# EAGLE design photoduino.shield.shaton (EAGLE 6.4)
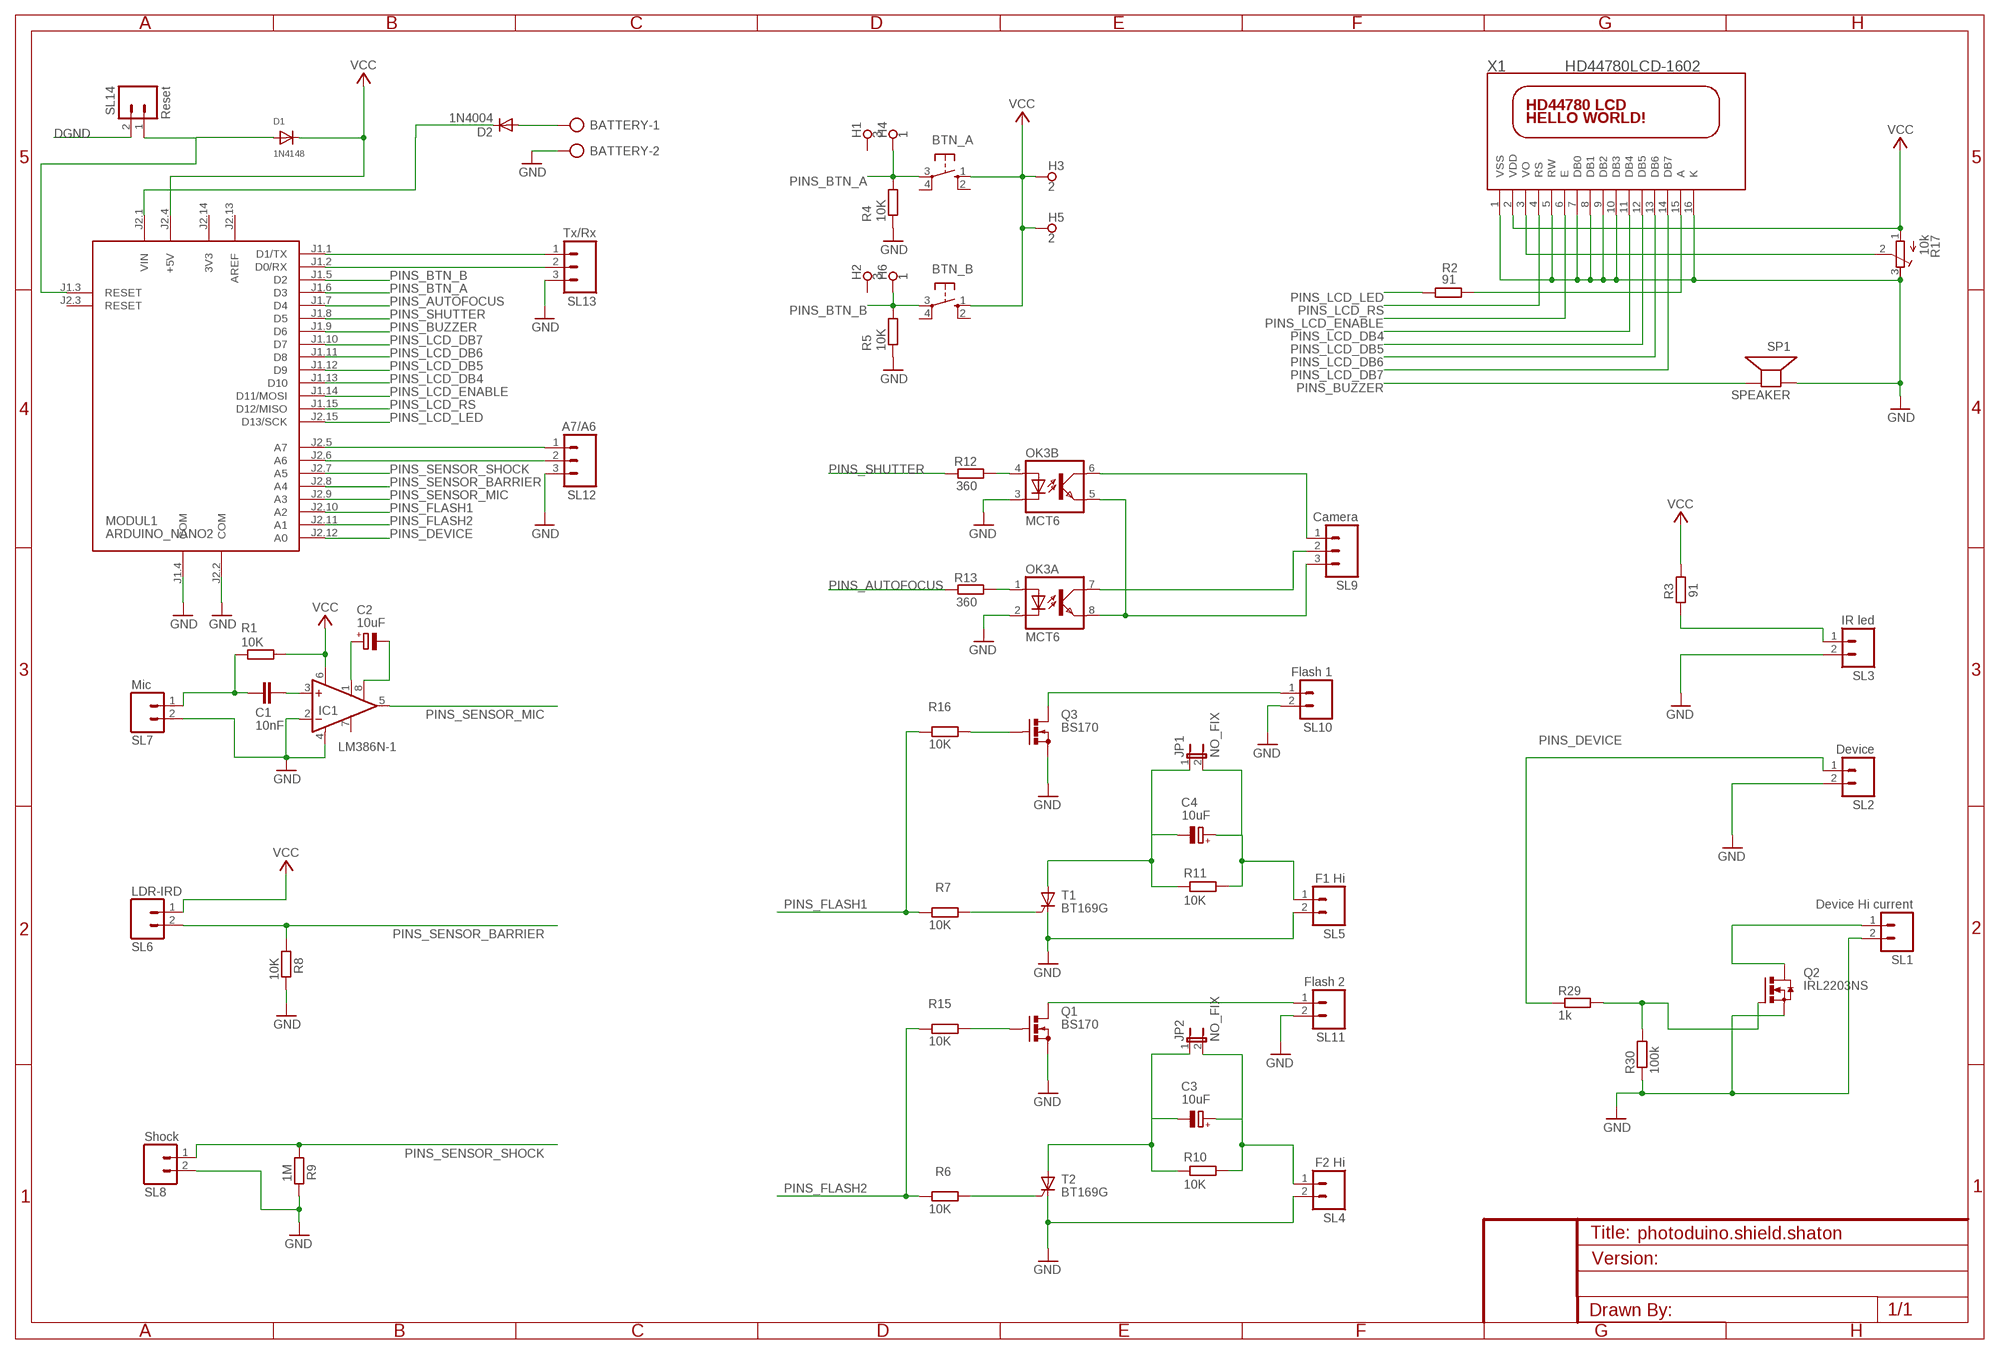
[diagram p0: schematic, sheet 1]

## Parts
BATTERY  AK500/2  [AK500/2]
BTN_A  10-XX  [B3F-10XX]
BTN_B  10-XX  [B3F-10XX]
C1  10nF  C-EU050-025X075  [C050-025X075]
C2  10uF  CPOL-EUE2.5-7  [E2,5-7]
C3  10uF  CPOL-EUE2.5-7  [E2,5-7]
C4  10uF  CPOL-EUE2.5-7  [E2,5-7]
D1  1N4148  DIODEDO-1N4148  [DO-1N4148]
D2  1N4004  [DO41-10]
H1  3  SPECIAL_DRILL_0.1000  [PAD_0.1000]
H2  3  SPECIAL_DRILL_0.1000  [PAD_0.1000]
H3  2  SPECIAL_DRILL_0.1000  [PAD_0.1000]
H4  1  SPECIAL_DRILL_0.1000  [PAD_0.1000]
H5  2  SPECIAL_DRILL_0.1000  [PAD_0.1000]
H6  1  SPECIAL_DRILL_0.1000  [PAD_0.1000]
IC1  LM386N-1  [DIL08]
JP1  NO_FIX  JP1E  [JP1]
JP2  NO_FIX  JP1E  [JP1]
MODUL1  ARDUINO_NANO2  [ARDUINO_NANO2]
OK3  MCT6  ILD2  [DIL08]
Q1  BS170  [SOT54E]
Q2  IRL2203NS  IRF3704S  [D2PACK]
Q3  BS170  [SOT54E]
R1  10K  R-EU_0207/7  [0207/7]
R2  91  R-EU_0207/7  [0207/7]
R3  91  R-EU_0207/7  [0207/7]
R4  10K  R-EU_0207/7  [0207/7]
R5  10K  R-EU_0207/7  [0207/7]
R6  10K  R-EU_0207/7  [0207/7]
R7  10K  R-EU_0207/7  [0207/7]
R8  10K  R-EU_0207/7  [0207/7]
R9  1M  R-EU_0207/7  [0207/7]
R10  10K  R-EU_0207/7  [0207/7]
R11  10K  R-EU_0207/7  [0207/7]
R12  360  R-EU_0207/7  [0207/7]
R13  360  R-EU_0207/7  [0207/7]
R15  10K  R-EU_0207/7  [0207/7]
R16  10K  R-EU_0207/7  [0207/7]
R17  10k  R-TRIMM64W  [RTRIM64W]
R29  1k  R-EU_0207/7  [0207/7]
R30  100k  R-EU_0207/7  [0207/7]
SL1  Device Hi current  M02  [02P]
SL2  Device  M02  [02P]
SL3  IR led  M02  [02P]
SL4  F2 Hi  M02  [02P]
SL5  F1 Hi  M02  [02P]
SL6  LDR-IRD  M02  [02P]
SL7  Mic  M02  [02P]
SL8  Shock  M02  [02P]
SL9  Camera  M03  [03P]
SL10  Flash 1  M02  [02P]
SL11  Flash 2  M02  [02P]
SL12  A7/A6  M03  [03P]
SL13  Tx/Rx  M03  [03P]
SL14  Reset  M02  [02P]
SP1  SPEAKER  SPEAKER/PS12  [PS12]
T1  BT169G  BT169  [TO92-2]
T2  BT169G  BT169  [TO92-2]
X1  HD44780LCD-1602  [LCD1602]

## Nets
DGND: BATTERY.2 IC1.2(-IN) IC1.4(GND) MODUL1.J1.4(COM) MODUL1.J2.2(COM) OK3.2(A:C) OK3.3(B:C) Q1.S Q2.3(S) Q3.S R4.1 R5.1 R8.2 R9.2 R17.3(A) R30.1 SL1.2 SL2.2 SL3.2 SL4.2 SL5.2 SL7.2 SL8.2 SL10.2 SL11.2 SL12.3 SL13.3 SL14.2 SP1.P$1(+) T1.C T2.C X1.1(VSS) X1.5(RW) X1.7(DB0) X1.8(DB1) X1.9(DB2) X1.10(DB3) X1.16(K) ; supply symbol labelled GND
LCD_CONTRAST: R17.2(S) X1.3(VO)
N$1: R3.2 SL3.1
N$2: OK3.5(B:EMIT) OK3.8(A:EMIT) SL9.3
N$3: C4.+ JP1.2 R11.2 SL5.1
N$4: R6.1 T2.G
N$5: D1.A MODUL1.J1.3(RESET) SL14.1
N$6: C4.- JP1.1 R11.1 T1.A
N$7: Q2.1(G) R29.2 R30.2
N$8: C3.+ JP2.2 R10.2 SL4.1
N$9: C3.- JP2.1 R10.1 T2.A
N$10: Q3.G R16.1
N$11: D2.C MODUL1.J2.1(VIN)
N$12: C1.1 IC1.3(+IN)
N$13: BATTERY.1 D2.A
N$14: MODUL1.J1.1(D1/TX) SL13.1
N$15: Q1.G R15.1
N$16: C1.2 R1.1 SL7.1
N$17: Q3.D SL10.1
N$18: R7.1 T1.G
N$19: Q1.D SL11.1
N$20: MODUL1.J1.2(D0/RX) SL13.2
N$21: OK3.6(B:COL) SL9.1
N$22: MODUL1.J2.5(A7) SL12.1
N$23: OK3.4(B:A) R12.1
N$24: MODUL1.J2.6(A6) SL12.2
N$25: OK3.1(A:A) R13.1
N$27: C2.+ IC1.1(GAIN)
N$28: Q2.2(D) SL1.1
N$31: C2.- IC1.8(GAIN)
N$32: R2.1 X1.15(A)
PINS_AUTOFOCUS: MODUL1.J1.7(D4) R13.2
PINS_BTN_A: BTN_A.3(P) H4.1 MODUL1.J1.6(D3) R4.2
PINS_BTN_B: BTN_B.3(P) H6.1 MODUL1.J1.5(D2) R5.2
PINS_BUZZER: MODUL1.J1.9(D6) SP1.P$2(-)
PINS_DEVICE: MODUL1.J2.12(A0) R29.1 SL2.1
PINS_FLASH1: MODUL1.J2.10(A2) R7.2 R16.2
PINS_FLASH2: MODUL1.J2.11(A1) R6.2 R15.2
PINS_LCD_DB4: MODUL1.J1.13(D10) X1.11(DB4)
PINS_LCD_DB5: MODUL1.J1.12(D9) X1.12(DB5)
PINS_LCD_DB6: MODUL1.J1.11(D8) X1.13(DB6)
PINS_LCD_DB7: MODUL1.J1.10(D7) X1.14(DB7)
PINS_LCD_ENABLE: MODUL1.J1.14(D11/MOSI) X1.6(E)
PINS_LCD_LED: MODUL1.J2.15(D13/SCK) R2.2
PINS_LCD_RS: MODUL1.J1.15(D12/MISO) X1.4(RS)
PINS_SENSOR_BARRIER: MODUL1.J2.8(A4) R8.1 SL6.2
PINS_SENSOR_MIC: IC1.5(OUT) MODUL1.J2.9(A3)
PINS_SENSOR_SHOCK: MODUL1.J2.7(A5) R9.1 SL8.1
PINS_SHUTTER: MODUL1.J1.8(D5) R12.2
SHUTTER: OK3.7(A:COL) SL9.2
VCC: BTN_A.1(S) BTN_B.1(S) D1.C H3.1 H5.1 IC1.6(VS) MODUL1.J2.4(+5V) R1.2 R3.1 R17.1(E) SL6.1 X1.2(VDD)
Unconnected: BTN_A.2(S1) BTN_A.4(P1) BTN_B.2(S1) BTN_B.4(P1) H1.1 H2.1 IC1.7(BYPASS) MODUL1.J2.3(RESET)

## Notes on the sheet
- DISPLAY LCD & BUZZER
- SENSORS
- SOUND SENSOR | BARRIER SENSOR | SHOCK SENSOR
- CONTROLLED DEVICES
- CAMERA CONTROL | FLASH1 CONTROL | FLASH2 CONTROL | DEVICE I/O PORT

## Power pins joined to a net without a drawn wire
3V3: MODUL1.J2.14(3V3)
AREF: MODUL1.J2.13(AREF)

## Library data of the parts
BATTERY = con-ptr500:AK500/2: CONNECTOR; OC_FARNELL: unknown; OC_NEWARK: unknown
BTN_A BTN_B = switch-omron:10-XX: OMRON SWITCH; MPN: B3F-1000; OC_FARNELL: 176432; OC_NEWARK: 36M3542
C1 = resistor:C-EU: CAPACITOR, European symbol
C2-C4 = resistor:CPOL-EU: POLARIZED CAPACITOR, European symbol
D1 = adafruit:DIODE: Diode SMADIODE - SMA Surface Mount Package 20V 1A Schottky Diode Digikey: 641-1014-6-ND DO-1N4148 - Through Hole Small Current Diode SOD-123 20V 1 A (.5mV Vf) Schottky Diode - Digikey: MBRX120TPMSCT-ND SOD-323 10V 570mA (.38mV Vf, 3ns) Schottky Diode - Digikey: ZLLS410CT-ND SOD-523 30V 30mA Schottky Diode (RB751S-40TE61) - Digikey: RB751S-40TE61CT-ND SOT23-R/W - SOT23 Package (R = Solder Paste/Reflow Ovens, W = Hand-Soldering) BAT54Film 40V 300mA - Digikey: 497-7162-1-ND
D2 = adafruit:1N4004: DIODE General purpose 1N400x type rectifier (With bigger pads) http://www.ladyada.net/library/pcb/eaglelibrary.html
H1-H6 = special-drill:SPECIAL_DRILL_: Special drills
IC1 = linear:LM386?-*: Low Voltage Audio Power Amplifier Source: http://cache.national.com/ds/LM/LM386.pdf
JP1 JP2 = jumper:JP1E: JUMPER
MODUL1 = arduino:ARDUINO_NANO2: Arduino Nano2 Auto generated by modulcreator.ulp \;; ANZAHL: 2; MODUL: TRUE; STECKX0: -76200; STECKX1: 76200; STECKY0: 177800; STECKY1: 177800
OK3 = optocoupler:ILD2: SIEMENS OPTO COUPLER; OC_FARNELL: 1469596; OC_NEWARK: unknown
Q1 Q3 = transistor-small-signal:BS170: N-CHANNEL MOS FET
Q2 = transistor-power:IRF3704: SMPS MOSFET HEXFET® Power MOSFET Source: http://www.irf.com/product-info/datasheets/data/irf3704.pdf
R1-R13 R15 R16 R29 R30 = resistor:R-EU_: RESISTOR, European symbol
R17 = resistor:R-TRIMM: Trimm resistor
SL1-SL8 SL10 SL11 SL14 = con-amp-quick:M02: AMP QUICK CONNECTOR; OC_FARNELL: unknown; OC_NEWARK: unknown
SL9 SL12 SL13 = con-amp-quick:M03: AMP QUICK CONNECTOR; OC_FARNELL: unknown; OC_NEWARK: unknown
SP1 = adafruit:SPEAKER: SPEAKER Source: Buerklin Added PS12 (for part # PS1240 piezo) http://www.ladyada.net/library/pcb/eaglelibrary.html
T1 T2 = componentes:BT169: THYRISTOR
X1 = adafruit:HD44780LCD: HD44780 LCD Standard character type LCDs, available in sizes from 8x1 to 40x4!

## Net classes
2 gnd: width 0.305 mm, drill 0.559 mm, clearance 0.254 mm

## Board
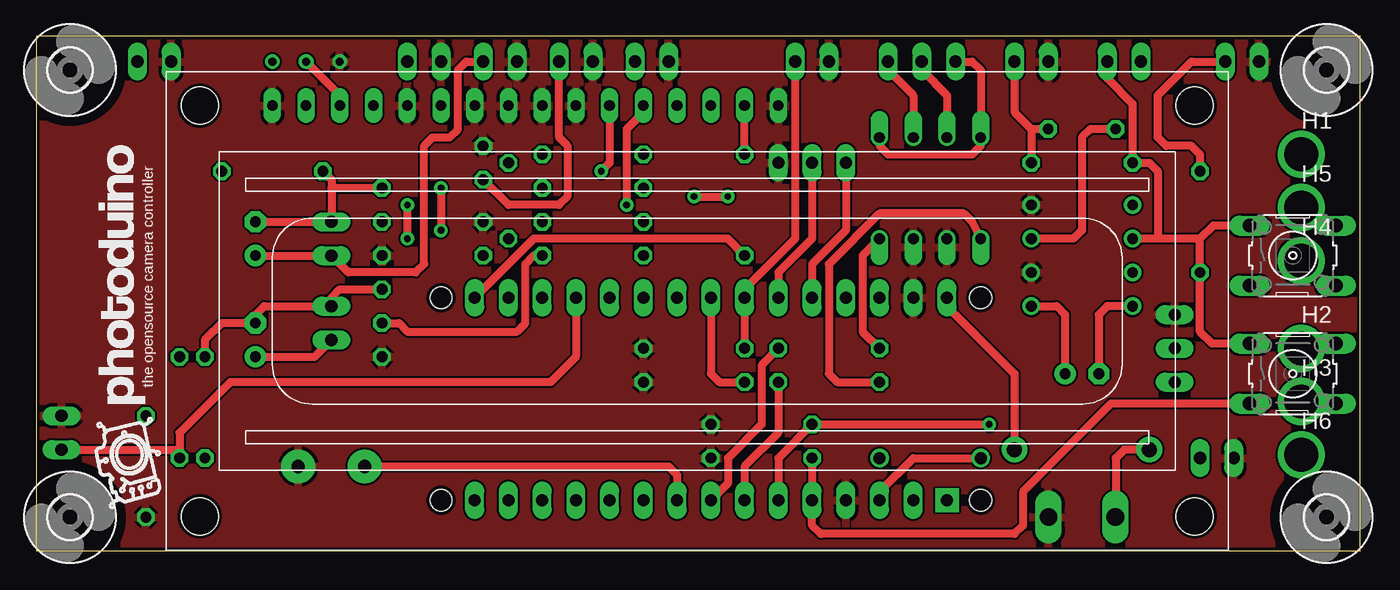
[diagram p1: board, top side]
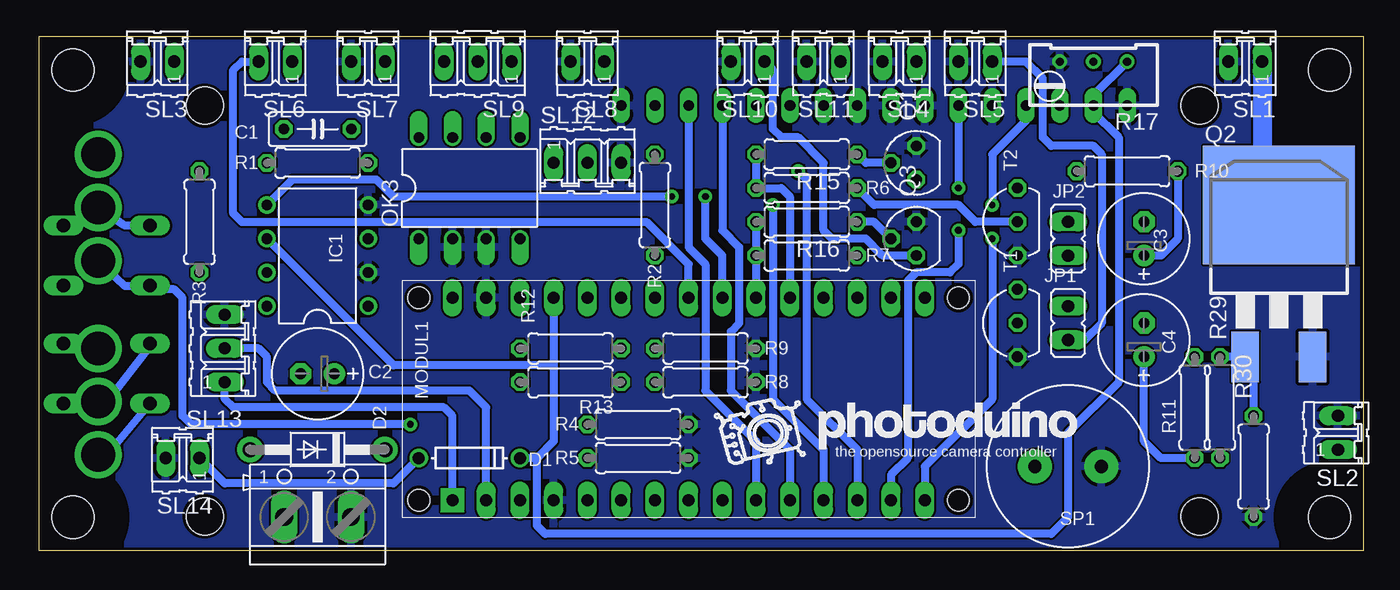
[diagram p2: board, bottom side, seen from below]

Size 99.69 x 38.73 mm. Coordinates in mm from the lower left corner, seen from the top.
Outline: 99.69,38.73 0,38.73 0,0 99.69,0 99.69,38.73
Copper layers (1*16): Top 0.035mm / dielectric 1.5mm / Bottom 0.035mm
Design rules "ITEADstudio_DRC": minimum track width 6mil, minimum drill 12mil, track to track 6mil, track to pad 6mil, pad to pad 6mil, via to via 6mil, smd to smd 0mil, copper to edge 10mil, drill to drill 10mil, minimum pad ring 10mil, minimum via ring 6mil, stop-mask expansion 2mil, vias tented up to drill 100mil, thermal gap 10mil

### Footprints (pad centres in the part's own frame; a part is rotated, then mirrored left to right if it is on the bottom)
AK500/2 = drill 1.321 long: 1 -2.515,0; 2 2.515,0
B3F-10XX = drill 1.016 long: 1 -3.251,2.261; 2 3.251,2.261; 3 -3.251,-2.261; 4 3.251,-2.261
C050-025X075 = drill 0.813 octagon: 1 -2.54,0; 2 2.54,0
E2,5-7 = drill 0.813 pad 1.6: + -1.27,0 | drill 0.813 pad 1.6 octagon: - 1.27,0
DO-1N4148 = drill 0.9: A -3.81,0; C 3.81,0
DO41-10 = drill 1.118 pad 1.93: A 5.08,0; C -5.08,0
PAD_0.1000 = drill 2.54 pad 2.54: 1 0,0
DIL08 = drill 0.813 pad 1.27: 1 -3.81,-3.81; 2 -1.27,-3.81; 3 1.27,-3.81; 4 3.81,-3.81; 5 3.81,3.81; 6 1.27,3.81; 7 -1.27,3.81; 8 -3.81,3.81
JP1 = drill 0.914 long: 1 0,-1.27; 2 0,1.27
ARDUINO_NANO2 = drill 0.914 pad 1.778 square: J1.1 -7.62,17.78 | drill 0.914 pad 1.422 long: J1.2 -7.62,15.24; J1.3 -7.62,12.7; J1.4 -7.62,10.16; J1.5 -7.62,7.62; J1.6 -7.62,5.08; J1.7 -7.62,2.54; J1.8 -7.62,0; J1.9 -7.62,-2.54; J1.10 -7.62,-5.08; J1.11 -7.62,-7.62; J1.12 -7.62,-10.16; J1.13 -7.62,-12.7; J1.14 -7.62,-15.24; J1.15 -7.62,-17.78; J2.1 7.62,17.78; J2.2 7.62,15.24; J2.3 7.62,12.7; J2.4 7.62,10.16; J2.5 7.62,7.62; J2.6 7.62,5.08; J2.7 7.62,2.54; J2.8 7.62,0; J2.9 7.62,-2.54; J2.10 7.62,-5.08; J2.11 7.62,-7.62; J2.12 7.62,-10.16; J2.13 7.62,-12.7; J2.14 7.62,-15.24; J2.15 7.62,-17.78 | hole 1.651: -7.62,-20.32; 7.62,-20.32; 7.62,20.32; -7.62,20.32
DIL08' = drill 0.813 offset: 1 -3.81,-3.81; 2 -1.27,-3.81; 3 1.27,-3.81; 4 3.81,-3.81; 5 3.81,3.81; 6 1.27,3.81; 7 -1.27,3.81; 8 -3.81,3.81
SOT54E = drill 0.813 octagon: D -1.27,0; G 0,1.905; S 1.27,0
D2PACK = smd 2.083 x 3.81: 1 -2.54,-8.89; 3 2.54,-8.89 | smd 11.43 x 8.89: 2 0,2.54
0207/7 = drill 0.813 octagon: 1 -3.81,0; 2 3.81,0
RTRIM64W = drill 0.61: 1 1.27,-2.54; 2 1.27,0; 3 1.27,2.54
02P = drill 0.914 long: 1 -1.27,0; 2 1.27,0
03P = drill 0.914 long: 1 -2.54,0; 2 0,0; 3 2.54,0
PS12 = drill 1 pad 2.54: P$1 -2.5,0; P$2 2.5,0
TO92-2 = drill 0.813 octagon: A 2.54,0; C -2.54,0; G 0,0
3,2 = hole 3.2: 0,0
LCD1602 = drill 0.8 long: 1 8,33.46; 2 10.54,33.46; 3 13.08,33.46; 4 15.62,33.46; 5 18.16,33.46; 6 20.7,33.46; 7 23.24,33.46; 8 25.78,33.46; 9 28.32,33.46; 10 30.86,33.46; 11 33.4,33.46; 12 35.94,33.46; 13 38.48,33.46; 14 41.02,33.46; 15 43.56,33.46; 16 46.1,33.46 | hole 2.8: 2.54,2.54; 2.54,33.46; 77.46,33.46; 77.46,2.54

### Placement (x,y rotation side)
BATTERY  78.74,2.54 0 bottom
BTN_A  94.61,22.23 0 top
BTN_B  94.61,13.34 0 top
C1  78.74,31.75 0 bottom
C2  78.74,13.34 180 bottom
C3  16.51,23.5 90 bottom
C4  16.51,15.88 90 bottom
D1  67.31,6.99 0 bottom
D2  78.74,7.62 180 bottom
H1  95.25,29.84 0 top
H2  95.25,15.24 0 top
H3  95.25,11.24 0 top
H4  95.25,21.84 0 top
H5  95.25,25.84 0 top
H6  95.25,7.24 0 top
IC1  78.74,22.23 90 bottom
JP1  22.23,17.14 180 bottom
JP2  22.23,23.5 180 bottom
MODUL1  50.8,11.43 90 bottom
OK3  MCT6  [DIL08']  67.31,27.3 0 bottom
Q1  33.66,29.21 90 bottom
Q2  6.35,23.5 0 bottom
Q3  33.66,23.5 90 bottom
R1  78.74,29.21 180 bottom
R2  53.34,26.04 270 bottom
R3  87.63,24.77 90 bottom
R4  54.61,9.53 180 bottom
R5  54.61,6.99 180 bottom
R6  41.91,27.3 180 bottom
R7  41.91,22.23 180 bottom
R8  49.53,12.7 0 bottom
R9  49.53,15.24 0 bottom
R10  17.78,28.57 0 bottom
R11  12.7,10.79 270 bottom
R12  59.69,15.24 0 bottom
R13  59.69,12.7 0 bottom
R15  41.91,29.84 180 bottom
R16  41.91,24.77 180 bottom
R17  20.32,35.56 90 bottom
R29  10.79,10.79 90 bottom
R30  8.26,6.35 90 bottom
SL1  8.89,36.83 180 bottom
SL2  1.91,8.89 90 bottom
SL3  90.81,36.83 180 bottom
SL4  34.92,36.83 180 bottom
SL5  29.21,36.83 180 bottom
SL6  81.92,36.83 180 bottom
SL7  74.93,36.83 180 bottom
SL8  58.42,36.83 180 bottom
SL9  66.67,36.83 180 bottom
SL10  46.35,36.83 180 bottom
SL11  40.64,36.83 180 bottom
SL12  58.42,29.21 0 bottom
SL13  85.72,15.24 90 bottom
SL14  88.9,6.99 180 bottom
SP1  22.23,6.35 180 bottom
T1  26.04,17.14 90 bottom
T2  26.04,24.77 90 bottom
U$1  [LOGOPHOTODUINO2]  48.9,6.35 0 bottom
U$2  [LOGOPHOTODUINO2]  9.53,3.17 90 top
U$3  [3,2]  2.54,36.2 0 top
U$4  [3,2]  2.54,2.54 0 top
U$5  [3,2]  97.16,2.54 0 top
U$6  [3,2]  97.16,36.2 0 top
X1  9.77,0.05 0 top

### Tracks (layer width: path | path; a pad name or v marks a point on that pad's centre or on a via)
DGND
  pour Bottom (isolate 0.15): -0.64,39.37 -0.64,-0.64 100.33,-0.64 100.33,39.37
  pour Top (isolate 0.15): 100.33,39.37 100.33,-0.64 -0.64,-0.64 -0.64,39.37
LCD_CONTRAST
  Top 0.61: R17.2 22.86,34.29 X1.3
N$1
  Top 0.61: R3.2 87.63,29.84 87,30.48 85.09,30.48 84.45,31.11 84.45,34.29 87,36.83 SL3.1
N$2
  Top 0.61: SL9.3 70.48,36.83 71.12,36.2 OK3.8 71.12,30.48 70.48,29.84 64.14,29.84 63.5,30.48 OK3.5
N$3
  Top 0.61: C4.+ 20.95,14.61 JP1.2
  Bottom 0.61: R11.2 15.24,6.99 16.51,8.26 C4.+ | JP1.2 20.95,15.88 19.68,17.14 19.68,29.84 20.32,30.48 23.5,30.48 24.13,31.11 24.13,35.56 25.4,36.83 SL5.1
N$4
  Bottom 0.61: T2.G 29.21,24.77 30.48,26.04 36.83,26.04 R6.1
N$5
  Top 0.61: MODUL1.J1.3 63.5,4.45 66.04,6.99 D1.A
  Bottom 0.61: D1.A 73.03,5.08 85.72,5.08 SL14.1
N$6
  Top 0.61: R11.1 12.7,15.88 13.97,17.14 C4.- 16.51,17.78 17.14,18.41 JP1.1 22.23,19.05 22.86,19.68 T1.A
N$7
  Bottom 0.61: R29.2 Q2.1 8.89,13.97 8.26,13.34 R30.2
N$8
  Top 0.61: C3.+ JP2.2 23.5,20.95 28.57,20.95 29.21,21.59 29.21,30.48 29.84,31.11 31.11,31.11 31.75,31.75 31.75,36.2 32.38,36.83 SL4.1
  Bottom 0.61: R10.2 13.97,23.5 15.24,22.23 C3.+
N$9
  Top 0.61: R10.1 22.23,27.94 22.23,27.3 | 22.23,27.3 JP2.1 C3.- | T2.A 22.23,27.3
N$10
  Bottom 0.61: Q3.G 36.83,24.77 R16.1
N$11
  Top 0.61: MODUL1.J2.1 68.58,18.41 73.66,13.34 D2.C
N$12
  Top 0.61: C1.1 79.38,31.75 78.74,31.11 78.74,24.13 78.11,23.5 IC1.3
N$13
  Top 0.61: D2.A 81.92,7.62 81.28,6.99 81.28,2.56 BATTERY.1
N$14
  Bottom 0.61: MODUL1.J1.1 68.58,10.16 69.22,10.79 85.09,10.79 85.72,11.43 SL13.1
N$15
  Bottom 0.61: Q1.G 37.47,29.21 R15.1
N$16
  Top 0.61: SL7.1 73.66,33.02 74.93,31.75 | C1.2 74.93,31.75 | 74.93,31.75 R1.1
N$17
  Bottom 0.61: Q3.D 36.2,22.23 37.47,23.5 40.01,23.5 40.64,24.13 40.64,29.21 42.55,31.11 43.81,31.11 44.45,31.75 44.45,36.2 SL10.1
N$18
  Top 0.61: T1.G 27.3,17.14 27.94,16.51 36.2,16.51 36.83,17.14 36.83,21.59 37.47,22.23 R7.1
N$19
  Top 0.61: Q1.D 35.56,26.04 39.37,26.04 40.01,26.67 40.01,30.48 39.37,31.11 SL11.1
N$20
  Bottom 0.61: MODUL1.J1.2 66.04,10.79 67.31,12.06 81.92,12.06 82.55,12.7 82.55,14.61 83.19,15.24 SL13.2
N$21
  Top 0.61: SL9.1 64.14,36.2 66.04,34.29 OK3.6
N$22
  Top 0.61: SL12.1 60.96,24.13 58.42,21.59 MODUL1.J2.5
N$23
  Top 0.61: OK3.4 62.23,22.23 62.23,16.51 R12.1
N$24
  Top 0.61: SL12.2 58.42,23.5 55.88,20.95 MODUL1.J2.6
N$25
  Top 0.61: OK3.1 70.48,24.77 69.85,25.4 63.5,25.4 59.69,21.59 59.69,13.34 60.33,12.7 R13.1
N$27
  Top 0.61: IC1.1 76.83,18.41 77.47,17.78 C2.+
N$28
  Bottom 0.61: 7.62,26.67 6.99,26.67 Q2.2
  Bottom 1.422: SL1.1 7.62,26.67
N$31
  Top 0.61: IC1.8 80.64,18.41 80.01,17.78 C2.-
N$32
  Top 0.61: R2.1 X1.15
PINS_AUTOFOCUS
  Top 0.61: R13.2 55.88,8.89 53.34,6.35 MODUL1.J1.7
PINS_BTN_A  (via drill 0.5 pad 1.02)
  Top 0.61: MODUL1.J1.6 55.88,6.99 R4.2 v71.75,9.53
  Bottom 0.61: v71.75,9.53 88.27,9.53 88.9,10.16 88.9,19.05 89.53,19.68 91.64,19.68 BTN_A.3 93.24,19.94 H4.1
PINS_BTN_B
  Top 0.61: R5.2 MODUL1.J1.5 58.42,1.91 59.05,1.27 73.66,1.27 74.3,1.91 74.3,4.45 80.92,11.07 BTN_B.3
  Bottom 0.61: H6.1 94.56,7.24 BTN_B.3
PINS_BUZZER
  Top 0.61: SP1.P$2 47.62,6.35 48.26,5.71 MODUL1.J1.9
PINS_DEVICE
  Top 0.61: MODUL1.J2.12 40.64,14.61 38.73,12.7 14.61,12.7 10.79,8.89 10.79,7.62 | SL2.1 10.79,7.62 | 10.79,7.62 R29.1
PINS_FLASH1
  Bottom 0.61: R16.2 R7.2 MODUL1.J2.10
PINS_FLASH2
  Bottom 0.61: R15.2 R6.2 43.81,27.3 43.18,26.67 MODUL1.J2.11
PINS_LCD_DB4  (via drill 0.5 pad 1.02)
  Top 0.61: X1.11 43.17,29.2 v42.55,28.57
  Bottom 0.61: v42.55,28.57 41.91,27.94 41.91,11.43 38.1,7.62 MODUL1.J1.13
PINS_LCD_DB5  (via drill 0.5 pad 1.02)
  Top 0.61: X1.12 45.71,33.01 44.45,31.75 v44.45,26.04
  Bottom 0.61: v44.45,26.04 44.45,11.43 40.64,7.62 MODUL1.J1.12
PINS_LCD_DB6
  Bottom 0.61: X1.13 48.25,24.12 46.99,22.86 46.99,17.14 47.62,16.51 47.62,12.06 43.18,7.62 MODUL1.J1.11
PINS_LCD_DB7
  Bottom 0.61: X1.14 50.79,22.85 49.53,21.59 49.53,12.06 45.72,8.26 MODUL1.J1.10
PINS_LCD_ENABLE  (via drill 0.5 pad 1.02)
  Top 0.61: v30.48,27.3 v30.48,24.13
  Bottom 0.61: X1.6 30.47,27.95 30.48,27.94 v30.48,27.3 | v30.48,24.13 30.48,21.59 31.11,20.95 33.66,20.95 34.29,20.32 34.29,6.99 35.56,5.71 MODUL1.J1.14
PINS_LCD_LED
  Top 0.61: R2.2 52.07,23.5 37.47,23.5 MODUL1.J2.15
PINS_LCD_RS  (via drill 0.5 pad 1.02)
  Top 0.61: v27.94,26.04 v27.94,23.5
  Bottom 0.61: MODUL1.J1.15 33.02,6.35 27.94,11.43 v27.94,23.5 | v27.94,26.04 27.94,29.84 25.4,32.38 X1.4
PINS_SENSOR_BARRIER
  Top 0.61: MODUL1.J2.8 50.8,13.34 51.44,12.7 R8.1
  Bottom 0.61: MODUL1.J2.8 50.8,21.59 53.98,24.77 84.45,24.77 85.09,25.4 85.09,36.2 84.45,36.83 SL6.2
PINS_SENSOR_MIC  (via drill 0.5 pad 1.02)
  Top 0.61: v49.53,26.67 v52.07,26.67
  Bottom 0.61: MODUL1.J2.9 48.26,22.23 49.53,23.5 v49.53,26.67 | v52.07,26.67 73.03,26.67 74.3,27.94 80.64,27.94 IC1.5
PINS_SENSOR_SHOCK
  Top 0.61: R9.1 MODUL1.J2.7 53.34,19.68 57.15,23.5 SL8.1
PINS_SHUTTER
  Top 0.61: R12.2 54.61,13.97 54.61,9.53 52.07,6.99 52.07,5.08 MODUL1.J1.8
SHUTTER
  Top 0.61: SL9.2 66.67,36.2 68.58,34.29 OK3.7
VCC
  Top 0.61: SL6.1 80.64,35.56 82.55,33.66 R1.2 83.82,29.21 84.45,28.57 84.45,23.5 | 84.45,23.5 IC1.6 | 87.63,23.5 R3.1 87.63,16.51 88.54,15.6 BTN_B.1 | 87.63,23.5 84.45,23.5 | BTN_A.1 88.62,24.49 87.63,23.5
  Bottom 0.61: 60.96,13.97 60.96,8.26 62.23,6.99 | 62.23,6.99 D1.C | MODUL1.J2.4 60.96,13.97 | 60.96,13.97 73.03,13.97 IC1.6 | 62.23,6.99 62.23,1.91 61.59,1.27 23.5,1.27 22.23,2.54 22.23,8.89 18.41,12.7 18.41,31.11 20.32,33.02 X1.2 20.32,34.29 R17.1 | BTN_B.1 91.36,15.32 91.44,15.24 94.42,11.43 H3.1 | BTN_A.1 93.26,24.49 H5.1

### Text on the board
bValues: V+